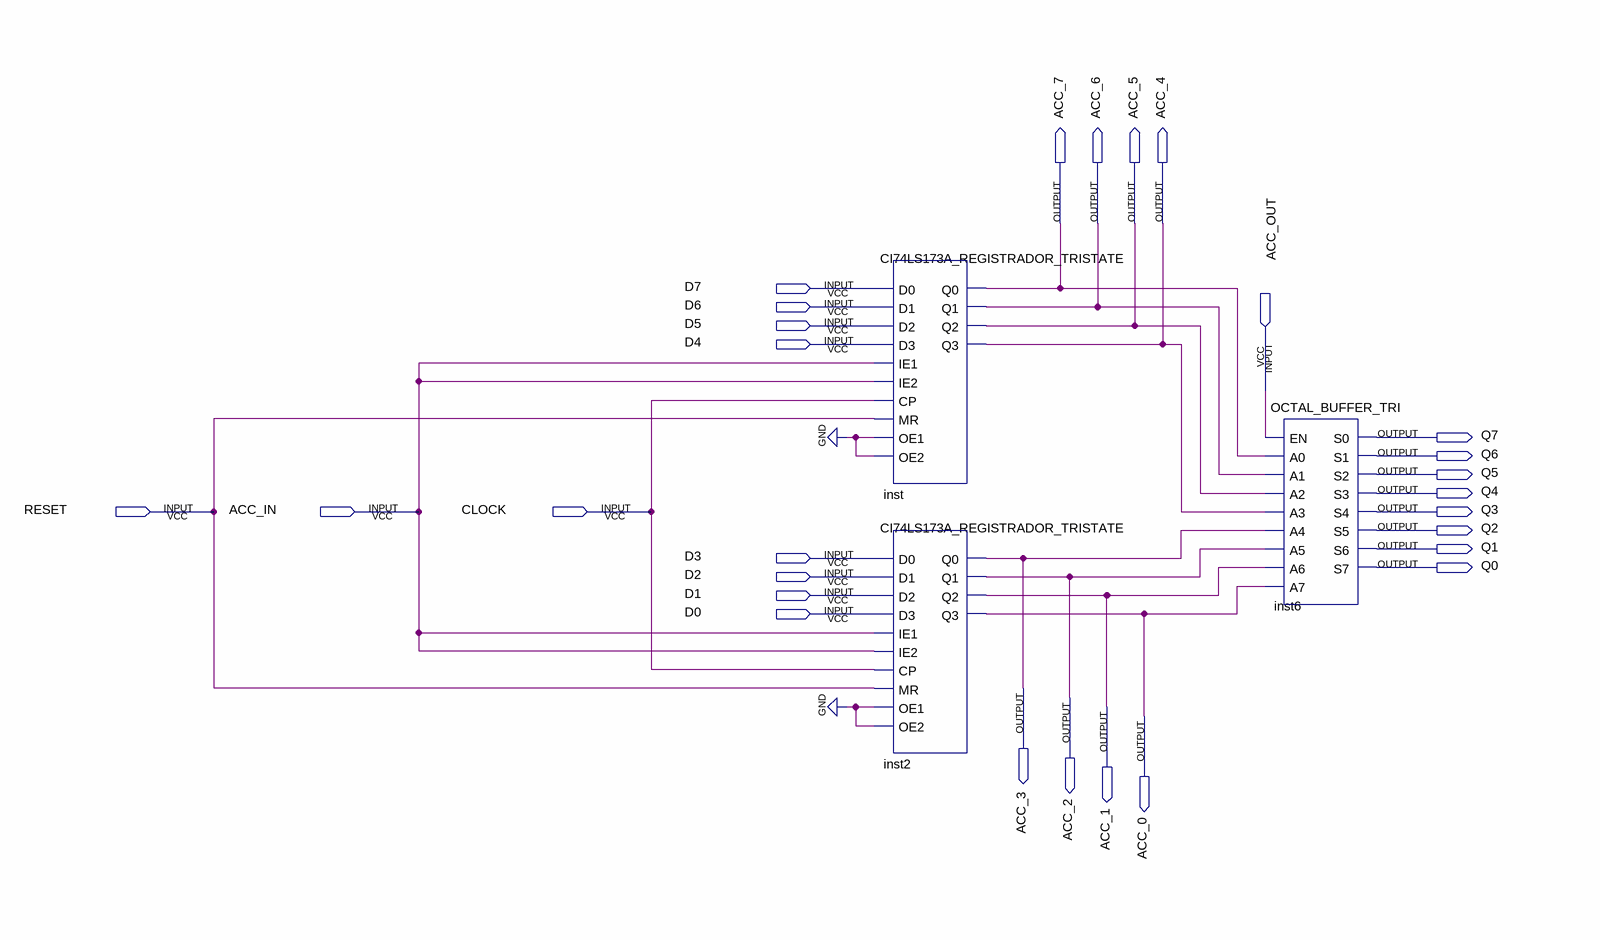
[diagram p0: schematic sheet]
// Quartus schematic Registrador_A.bdf as structural Verilog: 3 symbols, 28 pins
module Registrador_A (
  input  D7,
  input  D6,
  input  D5,
  input  D4,
  input  ACC_OUT,
  input  RESET,
  input  ACC_IN,
  input  CLOCK,
  input  D3,
  input  D2,
  input  D1,
  input  D0,
  output ACC_7,
  output ACC_6,
  output ACC_5,
  output ACC_4,
  output Q7,
  output Q6,
  output Q5,
  output Q4,
  output Q3,
  output Q2,
  output Q1,
  output Q0,
  output ACC_3,
  output ACC_2,
  output ACC_1,
  output ACC_0
);

  CI74LS173A_REGISTRADOR_TRISTATE inst (
    .D0(D7), .D1(D6), .D2(D5), .D3(D4), .IE1(ACC_IN), .IE2(ACC_IN), .CP(CLOCK), .MR(RESET), .OE1(1'b0),
    .OE2(1'b0), .Q2(ACC_5), .Q1(ACC_6), .Q3(ACC_4), .Q0(ACC_7));
  CI74LS173A_REGISTRADOR_TRISTATE inst2 (
    .D0(D3), .D1(D2), .D2(D1), .D3(D0), .IE1(ACC_IN), .IE2(ACC_IN), .CP(CLOCK), .MR(RESET), .OE1(1'b0),
    .OE2(1'b0), .Q2(ACC_1), .Q1(ACC_2), .Q3(ACC_0), .Q0(ACC_3));
  OCTAL_BUFFER_TRI inst6 (
    .EN(ACC_OUT), .A0(ACC_7), .A1(ACC_6), .A2(ACC_5), .A3(ACC_4), .A4(ACC_3), .A5(ACC_2), .A6(ACC_1),
    .A7(ACC_0), .S0(Q7), .S1(Q6), .S2(Q5), .S3(Q4), .S4(Q3), .S5(Q2), .S6(Q1), .S7(Q0));
endmodule
